# Altium schematic sheet 06_USB-UART Bridge.SchDoc
size A3; SheetNumber: 6; SheetTotal: 14
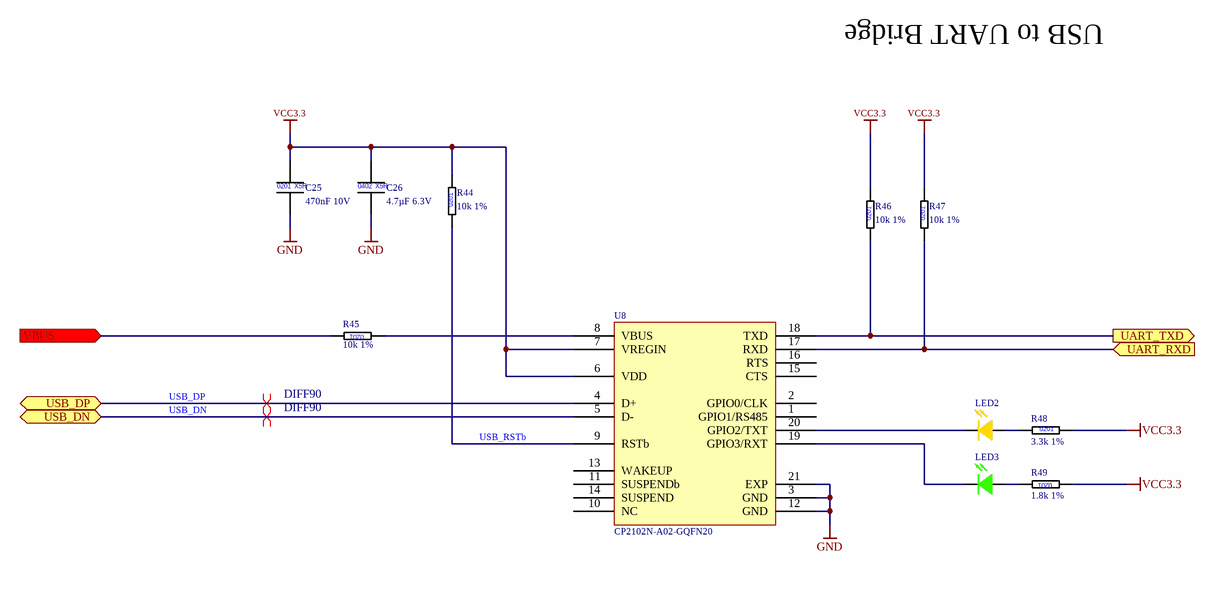
[diagram p0: 06_USB-UART Bridge.SchDoc]

## Parts
C25  470nF 10V  [CAPC0603X03L]
C26  4.7µF 6.3V  [CAPC1005X06L]
LED2  150040YS73220  [WL-SMCC_0402_H=0.25mm]  (value not drawn)
LED3  150040GS73220  [WL-SMCC_0402_H=0.25mm]  (value not drawn)
R44  10k 1%  [RESC0603X03L]
R45  10k 1%  [RESC0603X03L]
R46  10k 1%  [RESC0603X03L]
R47  10k 1%  [RESC0603X03L]
R48  3.3k 1%  [RESC0603X03L]
R49  1.8k 1%  [RESC0603X03L]
U8  CP2102N-A02-GQFN20  [QFN50P300X300X80_HS-17L]

## Ports
UART_RXD (in), UART_TXD (out), USB_DN (bidir), USB_DP (bidir), VBUS (in)

## Nets
GND: C25.2 C26.2 U8.3(GND) U8.12(GND) U8.21(EXP)
VCC3.3: C25.1 C26.1 R44.2 R46.2 R47.2 R48.2 R49.1 U8.6(VDD) U8.7(VREGIN)
UART_RXD: R47.1 U8.17(RXD) ; port UART_RXD
UART_TXD: R46.1 U8.18(TXD) ; port UART_TXD
USB_DN: U8.5(D-) ; port USB_DN
USB_DP: U8.4(D+) ; port USB_DP
USB_RSTb: R44.1 U8.9(RSTb)
VBUS: R45.2 ; port VBUS
NetLED2_1: LED2.1 U8.20(GPIO2/TXT)
NetLED2_2: LED2.2 R48.1
NetLED3_1: LED3.1 U8.19(GPIO3/RXT)
NetLED3_2: LED3.2 R49.2
NetR45_1: R45.1 U8.8(VBUS)

Not connected (* = marked no-connect by the designer): U8 1(GPIO1/RS485) 2(GPIO0/CLK) 10(NC) 11(SUSPENDb) 13(WAKEUP) 14(SUSPEND) 15(CTS) 16(RTS)

## Layout directives
differential pair; net class DIFF90: USB_DN, USB_DP

## Notes on the sheet
- USB to UART Bridge
- Title:
- ++CONFIDENTIAL++
- Datum:
- Blatt:
- von:
- Zeit:
- Entwickler:
- Der transparenteste Entwicklungsdienstleister
  der Elektronik- und Softwareentwicklung
- The  information  contained  in  these  documents  is  confidential,  privileged  and  only  for  the
  information of the intended recipient and may
  not be used, published or redistributed without
  the prior written consent from PCB Arts GmbH.
- Revision:
- Checked:
- https://pcb-arts.com/
- mail@pcb-arts.com
- (in symbol CAP_0201_470nF_10V) 0201; X5R
- (in symbol CAP_0402_4.7µ_6.3V) 0402; X5R
- (in symbol RES_0201_1.8k_1%) 0201
- (in symbol RES_0201_3.3k_1%) 0201
- (in symbol RES_0201_10k_1%) 0201

## Library data of the parts
C25 = CAP_0201_470nF_10V: Multilayer Ceramic Capacitors MLCC - SMD/SMT 0201 10VDC; Manufacturer 1: Taiyo Yuden; Manufacturer 1 Prt. Nr.: LMK063BBJ474KPLF; Manufacturer 2 Prt. Nr.: C0603X5R1A474M030BC; Manufacturer 2: TDK
C26 = CAP_0402_4.7µ_6.3V: Multilayer Ceramic Capacitors MLCC - SMD/SMT 0402 6.3VDC; Manufacturer 1: Murata Electronics; Manufacturer 1 Prt. Nr.: GRM155R60J475ME47D; Manufacturer 2 Prt. Nr.: JMK105BC6475MV-F; Manufacturer 2: Taiyo Yuden
LED2 = 150040YS73220_SMD WL-SMCC SMT LED Mono-color: Standard LEDs - SMD WL-SMCC SMT LED Mono-color; Manufacturer 1: Wurth Elektronik; Manufacturer 1 Prt. Nr.: 150040YS73220
LED3 = 150040GS73220_SMD WL-SMCC SMT LED Mono-color: Standard LEDs - SMD WL-SMCC SMT LED Mono-color; Manufacturer 1: Wurth Elektronik; Manufacturer 1 Prt. Nr.: 150040GS73220
R44-R47 = RES_0201_10k_1%: Thick Film Resistors - SMD 10K OHM 1%; Manufacturer 1: Yageo; Manufacturer 1 Prt. Nr.: RC0201FR-0710KL; Manufacturer 2 Prt. Nr.: CRCW020110K0FNED; Manufacturer 2: Vishay / Dale
R48 = RES_0201_3.3k_1%: Thick Film Resistors - SMD 3.3K OHM 1%; Manufacturer 1: Panasonic; Manufacturer 1 Prt. Nr.: ERJ-1GNF3301C; Manufacturer 2 Prt. Nr.: CRCW02013K30FKED; Manufacturer 2: Vishay / Dale
R49 = RES_0201_1.8k_1%: Thick Film Resistors - SMD 1.8K OHM 1%; Manufacturer 1: Panasonic; Manufacturer 1 Prt. Nr.: ERJ-1GNF1801C; Manufacturer 2 Prt. Nr.: CRCW02011K80FKED; Manufacturer 2: Vishay / Dale
U8 = CP2102N-A02-GQFN20_USB Interface IC USB to UART bridge: USB Interface IC USB to UART bridge - QFN20; Manufacturer 1: Silicon Labs; Manufacturer 1 Prt. Nr.: CP2102N-A02-GQFN20